# Altium schematic sheet 04_NOTECARD-CONNECTION.SchDoc
size 420 x 297 mm; Web: www.byte-lab.com; PageNumber: 04
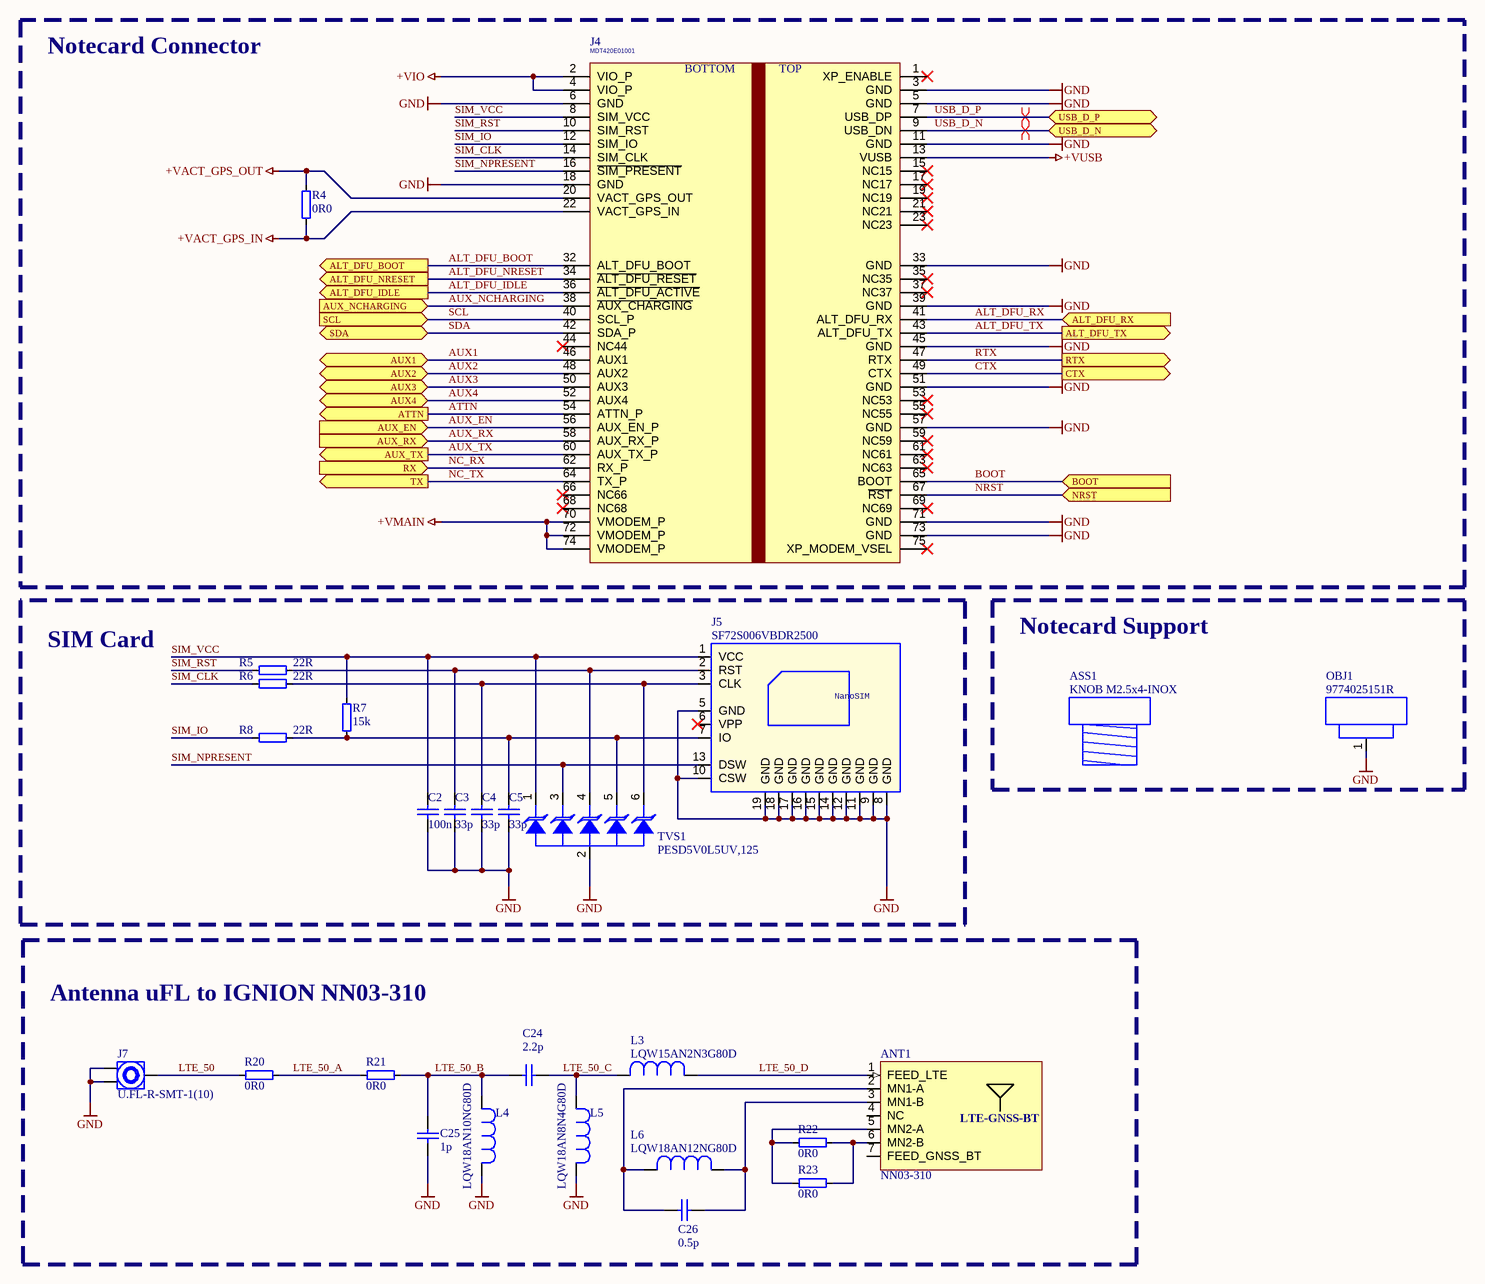
[diagram p0: 04_NOTECARD-CONNECTION.SchDoc]

## Parts
?  (no value)  (graphical)
ANT1  NN03-310  [XCVR_NN03-310]
ASS1  KNOB M2.5x4-INOX  (mechanical)
C2  100n  [C-0402]
C3  33p  [C-0402]
C4  33p  [C-0402]
C5  33p  [C-0402]
C24  2.2p  [MN_0402_0603]
C25  1p  [MN_0402_0603]
C26  0.5p  [MN_0402_0603]
J4  MDT420E01001  [J-75-0050-MOS-M2 - TELITWIFIV2]
J5  SF72S006VBDR2500  [J-NANOSIM-SF72S006VBA]
J7  U.FL-R-SMT-1(10)  [HRS_U.FL-R-SMT-1(10)]
L3  LQW15AN2N3G80D  [MN_0402_0603]
L4  LQW18AN10NG80D  [MN_0402_0603]
L5  LQW18AN8N4G80D  [MN_0402_0603]
L6  LQW18AN12NG80D  [MN_0402_0603]
OBJ1  9774025151R  [DIST-WASMSIM0250]
R4  0R0  [R-0603]
R5  22R  [R-0402]
R6  22R  [R-0402]
R7  15k  [R-0402]
R8  22R  [R-0402]
R20  0R0  [MN_0402_0603]
R21  0R0  [MN_0402_0603]
R22  0R0  [MN_0402_0603]
R23  0R0  [MN_0402_0603]
TVS1  PESD5V0L5UV,125  [SOT666]

## Blocks framed on the sheet
Notecard Connector: J4 R4
SIM Card: C2-C5 J5 R5-R8 TVS1
Notecard Support: ASS1 OBJ1
Antenna uFL to IGNION NN03-310: ANT1 C24-C26 J7 L3-L6 R20-R23

## Ports
ALT_DFU_BOOT (out), ALT_DFU_IDLE (out), ALT_DFU_NRESET (out), ALT_DFU_RX (in), ALT_DFU_TX (out), ATTN (out), AUX1 (bidir), AUX2 (bidir), AUX3 (bidir), AUX4 (bidir), AUX_EN (in), AUX_NCHARGING (in), AUX_RX (in), AUX_TX (out), BOOT (in), CTX (out), NRST (in), RTX (out), RX (in), SCL (in), SDA (bidir), TX (out), USB_D_N (bidir), USB_D_P (bidir)

## Nets
+VACT_GPS_IN: J4.22(VACT_GPS_IN) R4.1
+VACT_GPS_OUT: J4.20(VACT_GPS_OUT) R4.2
+VIO: J4.2(VIO_P) J4.4(VIO_P)
+VMAIN: J4.70(VMODEM_P) J4.72(VMODEM_P) J4.74(VMODEM_P)
+VUSB: J4.13(VUSB)
GND: C2.1 C3.1 C4.1 C5.1 C25.1 J4.3(GND) J4.5(GND) J4.6(GND) J4.11(GND) J4.18(GND) J4.33(GND) J4.39(GND) J4.45(GND) J4.51(GND) J4.57(GND) J4.71(GND) J4.73(GND) J5.5(GND) J5.8(GND) J5.9(GND) J5.10(CSW) J5.11(GND) J5.12(GND) J5.14(GND) J5.15(GND) J5.16(GND) J5.17(GND) J5.18(GND) J5.19(GND) J7.1(GND) J7.3(GND) L4.1 L5.1 OBJ1.1 TVS1.2(A2)
ALT_DFU_BOOT: J4.32(ALT_DFU_BOOT) ; port ALT_DFU_BOOT
ALT_DFU_IDLE: J4.36(~{ALT_DFU_ACTIVE}) ; port ALT_DFU_IDLE
ALT_DFU_NRESET: J4.34(~{ALT_DFU_RESET}) ; port ALT_DFU_NRESET
ALT_DFU_RX: J4.41(ALT_DFU_RX) ; port ALT_DFU_RX
ALT_DFU_TX: J4.43(ALT_DFU_TX) ; port ALT_DFU_TX
ATTN: J4.54(ATTN_P) ; port ATTN
AUX1: J4.46(AUX1) ; port AUX1
AUX2: J4.48(AUX2) ; port AUX2
AUX3: J4.50(AUX3) ; port AUX3
AUX4: J4.52(AUX4) ; port AUX4
AUX_EN: J4.56(AUX_EN_P) ; port AUX_EN
AUX_NCHARGING: J4.38(~{AUX_CHARGING}) ; port AUX_NCHARGING
AUX_RX: J4.58(AUX_RX_P) ; port AUX_RX
AUX_TX: J4.60(AUX_TX_P) ; port AUX_TX
BOOT: J4.65(BOOT) ; port BOOT
CTX: J4.49(CTX) ; port CTX
LTE_50: J7.2(SIG) R20.1
LTE_50_A: R20.2 R21.1
LTE_50_B: C24.2 C25.2 L4.2 R21.2
LTE_50_C: C24.1 L3.2 L5.2
LTE_50_D: ANT1.1(FEED_LTE) L3.1
NC_RX: J4.62(RX_P) ; port RX
NC_TX: J4.64(TX_P) ; port TX
NRST: J4.67(~{RST}) ; port NRST
RTX: J4.47(RTX) ; port RTX
SCL: J4.40(SCL_P) ; port SCL
SDA: J4.42(SDA_P) ; port SDA
SIM_CLK: J4.14(SIM_CLK) R6.1
SIM_IO: J4.12(SIM_IO) R8.1
SIM_NPRESENT: J4.16(~{SIM_PRESENT}) J5.13(DSW) TVS1.3(C3)
SIM_RST: J4.10(SIM_RST) R5.1
SIM_VCC: C2.2 J4.8(SIM_VCC) J5.1(VCC) R7.2 TVS1.1(C1)
USB_D_N: J4.9(USB_DN) ; port USB_D_N
USB_D_P: J4.7(USB_DP) ; port USB_D_P
NetANT1_2: ANT1.2(MN1-A) C26.1 L6.2
NetANT1_3: ANT1.3(MN1-B) C26.2 L6.1
NetANT1_5: ANT1.5(MN2-A) R22.1 R23.1
NetANT1_6: ANT1.6(MN2-B) R22.2 R23.2
NetC3_2: C3.2 J5.2(RST) R5.2 TVS1.4(C4)
NetC4_2: C4.2 J5.3(CLK) R6.2 TVS1.6(C6)
NetC5_2: C5.2 J5.7(IO) R7.1 R8.2 TVS1.5(A5)

Not connected (* = marked no-connect by the designer): ANT1 4(NC) 7(FEED_GNSS_BT); J4 1(XP_ENABLE)* 15(NC15)* 17(NC17)* 19(NC19)* 21(NC21)* 23(NC23)* 35(NC35)* 37(NC37)* 44(NC44)* 53(NC53)* 55(NC55)* 59(NC59)* 61(NC61)* 63(NC63)* 66(NC66)* 68(NC68)* 69(NC69)* 75(XP_MODEM_VSEL)*; J5 6(VPP)*

## Layout directives
differential pair: USB_D_N, USB_D_P

## Notes on the sheet
- Board
- Project
- Page name
- Project Code
- Designer
- Internal Code
- Approved
- Customer
- Code
- Il presente progetto è tutelato dalla legge sul diritto d'autore, che vieta a terzi la riproduzione e l'utilizzo anche parziale senza il consenso di FAE Technology S.p.A.
- Data
- Rev.
- Rev. changes
- Sheet
- /
- (in symbol NANOSIM - J-NANOSIM-SF72S006VBA) NanoSIM
- (in symbol NN03-310) LTE-GNSS-BT
- (in symbol TELITWIFIV2) BOTTOM; TOP

## Library data of the parts
? = MyFAETechnology
ANT1 = NN03-310: Multiport top performance chip antenna component for GSM, UMTS, LTE, 5G, GNSS, Bluetooth (617 - 960MHz, 1710 - 2690MHz, 3300 - 3800MHz, 1561 - 1606 MHz and 2400 - 2500 MHz), signal booster; MF: Ignion; Pkg Type: SMD; SnapEDA_Link: https://www.snapeda.com/parts/NN03-310/Ignion/view-part/?ref=snap; Package: -; Value: *; MP: NN03-310; Check_prices: https://www.snapeda.com/parts/NN03-310/Ignion/view-part/?ref=eda; Manufacturer Part Number: NN03-310; Manufacturer: IGNION
ASS1 = KNOB - M2.5x4-INOX: VITE TCEI 2.5X4 ESAGONO INCASSATO A2 INOX; Manufacturer Part Number: M2.5X4/D7985-A2; Manufacturer: KRAFTBERG; BL Part Number: 6000-168; Drawn_By: Blues Wireless; Supplier Part Number 1: M2.5X4/D7985-A2; Supplier 1: TME; Package: -; Pkg Type: -
C2 = C0402-100n-16V-X7R: Capacitor ceramic 100n ±10% X7R 16V 0402; Manufacturer: Murata Electronics; BL Part Number: 2000-908; Manufacturer Part Number: GRM155R71C104KA88D; Drawn_By: Puskar; Checked_By: Dodig; Pkg Type: SMD; Supplier 1: Digi-Key; Supplier Part Number 1: 490-3261-1-ND; Note: *; DateModified: 27-08-2013; Package: 0402
C3-C5 = C0402-33p-50V-C0G-5: Capacitor ceramic 33p ±5% C0G 50V 0402; Manufacturer: Samsung Electro-Mechanics; BL Part Number: 2001-377; Manufacturer Part Number: CL05C330JB5NNNC; Drawn_By: Puskar; Checked_By: Dodig; Pkg Type: SMD; Supplier 1: Digi-Key; Supplier Part Number 1: 1276-1272-1-ND; Note: *; DateModified: 24-11-2013; Package: 0402
C24 = MN_C0402_0603-2.2p-50V-C0G: Capacitor ceramic 2.2p ±5% C0G 50V 0402; Manufacturer: Murata; Manufacturer Part Number: GJM1555C1H2R2WB01D; Note: *
C25 = MN_C0402_0603-1p-50V-C0G: Capacitor ceramic 1p ±5% C0G 50V 0402; Manufacturer: Murata; Manufacturer Part Number: GJM1555C1H1R0WB01J; Note: *
C26 = MN_C0402_0603-0.5p-50V-C0G: Capacitor ceramic 0.5p ±5% C0G 50V 0402; Manufacturer: Murata; Manufacturer Part Number: GJM1555C1HR50WB01D; Note: *
J4 = TELITWIFIV2: CONN. M.2 75P M/90° P=0.5 MDT420E01001 AMPHENOL SMT; Manufacturer: Amphenol ICC (FCI); Manufacturer Part Number: MDT420E03001; BL Part Number: 2007-460; Drawn_By: Blues Wireless; Supplier 1: Digi-Key; Supplier Part Number 1: MDT420E03001CT-ND
J5 = NANOSIM - J-NANOSIM-SF72S006VBA: CONN. NANOSIM 8P F/90° PUSH-PUSH SF72S006VBAR2500 JAE ELECTRONICS SMT; BL Part Number: 2007-458; Drawn_By: Blues Wireless; Supplier 1: Digi-Key; Supplier Part Number 1: 670-2967-1-ND; Manufacturer Part Number: SF72S006VBDR2500; Manufacturer: JAE Electronics
J7 = U.FL-R-SMT-1(10): U.FL Series 6 Ghz 50 Ohm Ultra-small SMT Coaxial Cable Receptacle; Manufacturer: Hirose; Pkg Type: SMD; Availability: Unavailable; Value: *; Price: None; Package: -; Manufacturer Part Number: U.FL-R-SMT-1(10)
L3 = MN_L0402_0603-2.3nH: 2.3 nH Inductor 2.53 A 22mOhm Max 0402; Manufacturer: Murata; Manufacturer Part Number: LQW15AN2N3G80D
L4 = MN_L0402_0603-10nH: 10 nH Inductor 1.6 A 52mOhm Max 0603; Manufacturer: Murata; Manufacturer Part Number: LQW18AN10NG80D
L5 = MN_L0402_0603-8.4nH: 8.4 nH Inductor 1.6 A 52mOhm Max 0603; Manufacturer: Murata; Manufacturer Part Number: LQW18AN8N4G80D
L6 = MN_L0402_0603-12nH: 12 nH Inductor 1.6 A 52mOhm Max 0603; Manufacturer: Murata; Manufacturer Part Number: LQW18AN12NG80D
OBJ1 = DISTANZIALE - M2.5x0250: DISTANZ. CIL. METALLO 5.1X2.5 9774025151R W.E SMT; Manufacturer: Würth Elektronik; BL Part Number: 6020-113; Drawn_By: Blues Wieless; Supplier 1: Digi-Key; Supplier Part Number 1: 732-7078-1-ND; Manufacturer Part Number: 9774025151R
R4 = R0603-0R0: Resistor 0R0 0603; Manufacturer Part Number: RC0603JR-070RL; Manufacturer: YAGEO; BL Part Number: 2000-723; Checked_By: Puskar; Drawn_By: Dodig; Pkg Type: SMD; DateModified: 07-12-2013; Note: *; Package: 0603
R5 R6 R8 = R0402-22R-1: Resistor 22R ±1% 0402; Manufacturer: YAGEO; Manufacturer Part Number: RC0402FR-0722RL; BL Part Number: 2001-170; Checked_By: Hamin; Drawn_By: Zvonc; Pkg Type: SMD; Supplier 1: Digi-Key; Supplier Part Number 1: 311-22.0LRCT-ND; DateModified: 13-02-2021; Note: *; Package: 0402
R7 = R0402-15k-1: Resistor 15k ±1% 0402; Manufacturer: Panasonic Electronic Components; Manufacturer Part Number: ERJ-2RKF1502X; BL Part Number: 2001-157; Checked_By: Zvonc; Drawn_By: Puskar; Pkg Type: SMD; Supplier 1: Digi-Key; Supplier Part Number 1: P15.0KLCT-ND; DateModified: 23-01-2015; Note: *; Package: 0402
R20-R23 = MN_R0603-0R0: Resistor 0R0 0603; Manufacturer Part Number: RC0603JR-070RL; Manufacturer: YAGEO; Pkg Type: SMD
TVS1 = PESD5V0L5UV,125: PESD Series 25 W 5 V Uni-Directional Fivefold ESD Protection Diode Array SOT-666; Manufacturer: Nexperia; BL Part Number: 2007-452; Drawn_By: Blues Wireless; Supplier 1: Digi-Key; Manufacturer Part Number: PESD5V0L5UV,125; Supplier Part Number 1: 1727-5797-1-ND